# EAGLE schematic LoRa ST v4.1 (EAGLE 9.6.2)
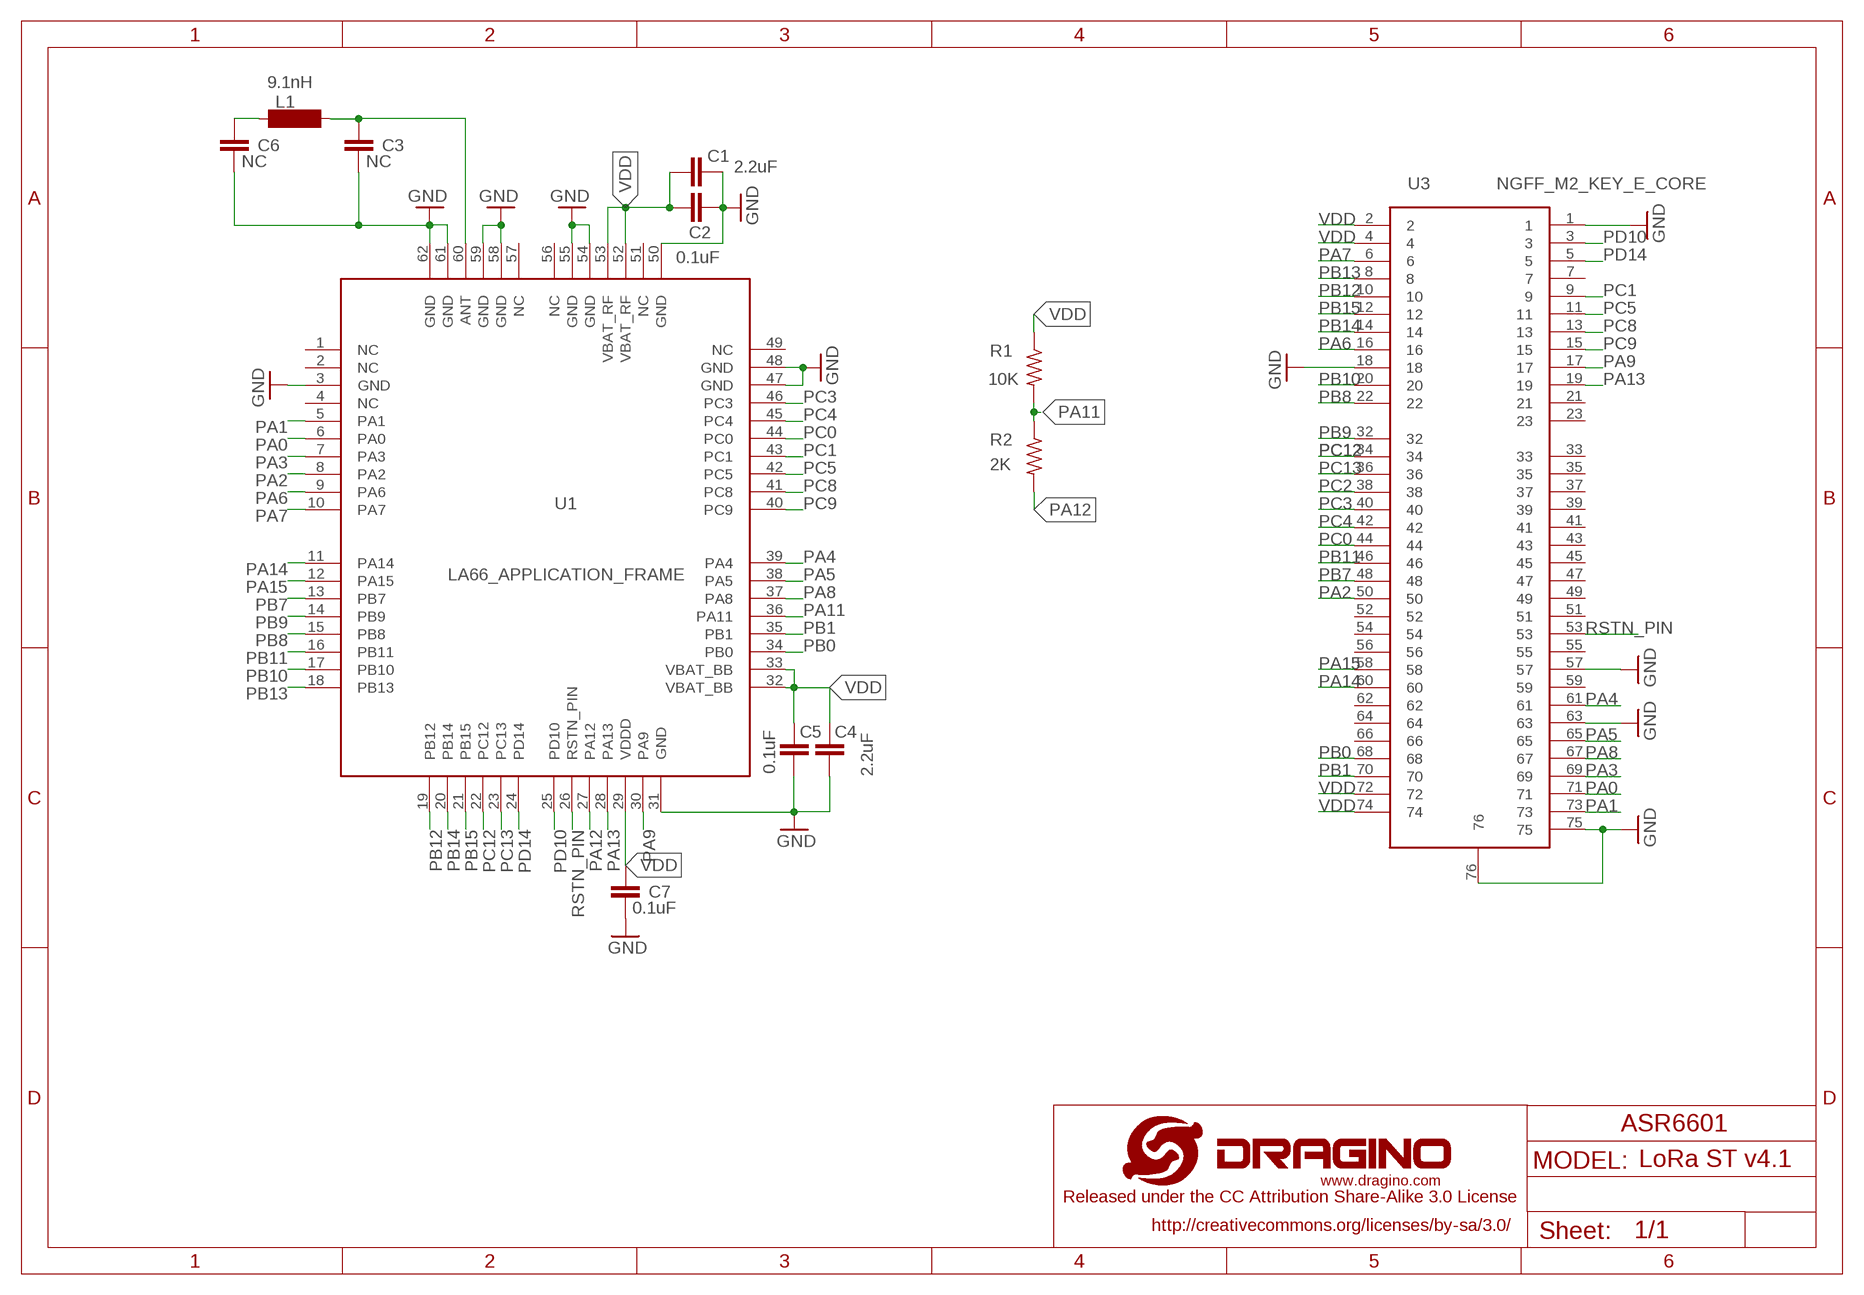
[diagram p0: schematic, sheet 1]

## Parts
C1  2.2uF  C-EUC0402  [C0402]
C2  0.1uF  C-EUC0402  [C0402]
C3  NC  C-EUC0402  [C0402]
C4  2.2uF  C-EUC0402  [C0402]
C5  0.1uF  C-EUC0402  [C0402]
C6  NC  C-EUC0402  [C0402]
C7  0.1uF  C-EUC0402  [C0402]
L1  9.1nH  L1  [L-0402]
R1  10K  R-US_R0402  [R0402]
R2  2K  R-US_R0402  [R0402]
U1  LA66_APPLICATION_FRAME  [LA66_APPLICATION_FRAME]
U3  NGFF_M2_KEY_E_CORE  [LORA_ST_PCB]

## Nets
GND: C1.1 C2.2 C3.1 C4.2 C5.1 C6.1 C7.1 U1.3(GND) U1.31(GND) U1.47(GND) U1.48(GND) U1.50(GND) U1.54(GND) U1.55(GND) U1.58(GND) U1.59(GND) U1.61(GND) U1.62(GND) U3.1 U3.18 U3.57 U3.63 U3.75 U3.76
N$1: C3.2 L1.1 U1.60(ANT)
N$2: C6.2 L1.2
PA0: U1.6(PA0) U3.71
PA1: U1.5(PA1) U3.73
PA2: U1.8(PA2) U3.50
PA3: U1.7(PA3) U3.69
PA4: U1.39(PA4) U3.61
PA5: U1.38(PA5) U3.65
PA6: U1.9(PA6) U3.16
PA7: U1.10(PA7) U3.6
PA8: U1.37(PA8) U3.67
PA9: U1.30(PA9) U3.17
PA11: R1.2 R2.1 U1.36(PA11)
PA12: R2.2 U1.27(PA12)
PA13: U1.28(PA13) U3.19
PA14: U1.11(PA14) U3.60
PA15: U1.12(PA15) U3.58
PB0: U1.34(PB0) U3.68
PB1: U1.35(PB1) U3.70
PB7: U1.13(PB7) U3.48
PB8: U1.15(PB8) U3.22
PB9: U1.14(PB9) U3.32
PB10: U1.17(PB10) U3.20
PB11: U1.16(PB11) U3.46
PB12: U1.19(PB12) U3.10
PB13: U1.18(PB13) U3.8
PB14: U1.20(PB14) U3.14
PB15: U1.21(PB15) U3.12
PC0: U1.44(PC0) U3.44
PC1: U1.43(PC1) U3.9
PC2: U3.38
PC3: U1.46(PC3) U3.40
PC4: U1.45(PC4) U3.42
PC5: U1.42(PC5) U3.11
PC8: U1.41(PC8) U3.13
PC9: U1.40(PC9) U3.15
PC12: U1.22(PC12) U3.34
PC13: U1.23(PC13) U3.36
PD10: U1.25(PD10) U3.3
PD14: U1.24(PD14) U3.5
RSTN_PIN: U1.26(RSTN_PIN) U3.53
VDD: C1.2 C2.1 C4.1 C5.2 C7.2 R1.1 U1.29(VDDD) U1.32(VBAT_BB) U1.33(VBAT_BB) U1.52(VBAT_RF) U1.53(VBAT_RF) U3.2 U3.4 U3.72 U3.74
Unconnected: U1.1(NC) U1.2(NC) U1.4(NC) U1.49(NC) U1.51(NC) U1.56(NC) U1.57(NC) U3.7 U3.21 U3.23 U3.33 U3.35 U3.37 U3.39 U3.41 U3.43 U3.45 U3.47 U3.49 U3.51 U3.52 U3.54 U3.55 U3.56 U3.59 U3.62 U3.64 U3.66

## Notes on the sheet
- ASR6601

## Library data of the parts
C1-C7 = dragino-passive:C-EU: CAPACITOR, European symbol
L1 = inductor-neosid:L
R1 R2 = dragino:R-US_: RESISTOR, American symbol
U1 = dragino:LA66_APPLICATION_FRAME
U3 = dragino:NGFF_M2_KEY_E

## Net classes
0 default: width 0.203 mm, clearance 0.152 mm
1 vcc: width 0.254 mm
2 gnd: width 0.305 mm, drill 0.33 mm, clearance 0.254 mm
3 2layer-50ohm: width 0.305 mm, clearance 0.152 mm
6 usbtrace-4layer: width 0.191 mm, clearance 0.152 mm